# EAGLE design esp32_moisture (EAGLE 9.6.2)

## Sheet 1 of 2
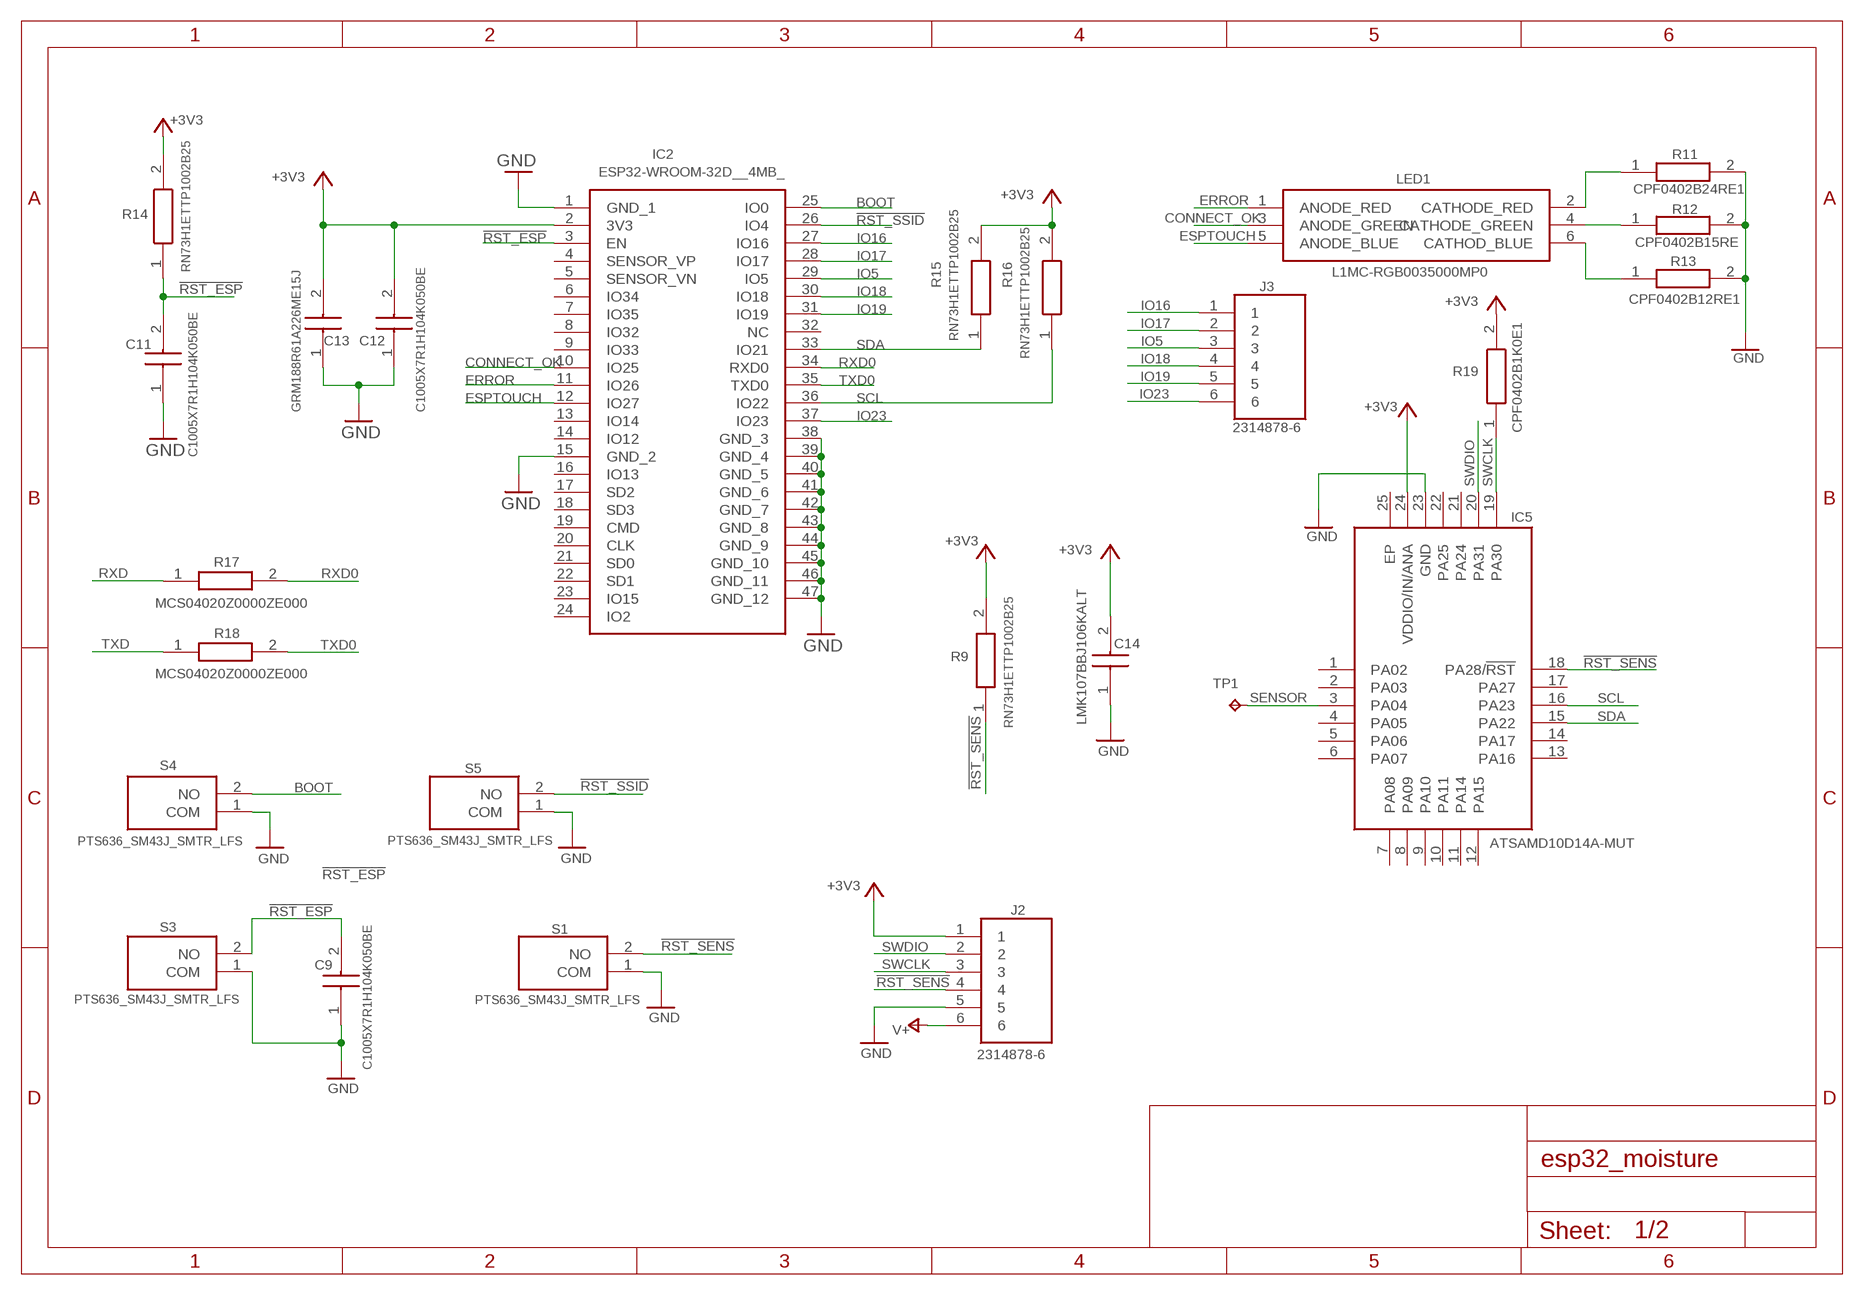
[diagram p0: schematic, sheet 1]

### Parts
C9  C1005X7R1H104K050BE  [CAPC1005X55N]
C11  C1005X7R1H104K050BE  [CAPC1005X55N]
C12  C1005X7R1H104K050BE  [CAPC1005X55N]
C13  GRM188R61A226ME15J  [CAPC1608X90N]
C14  LMK107BBJ106KALT  [CAPC1608X100N]
IC2  ESP32-WROOM-32D__4MB_  [ESP32WROOM32D4MB]
IC5  ATSAMD10D14A-MUT  [QFN50P400X400X90-25N]
J2  2314878-6  [RHDR6W40P0X200_1X6_1200X210X45]
J3  2314878-6  [RHDR6W40P0X200_1X6_1200X210X45]
LED1  L1MC-RGB0035000MP0  [L1MCRGB0035000MP0]
R9  RN73H1ETTP1002B25  [RESC1005X40N]
R11  CPF0402B24RE1  [RESC1005X35N]
R12  CPF0402B15RE  [RESC1005X35N]
R13  CPF0402B12RE1  [RESC1005X35N]
R14  RN73H1ETTP1002B25  [RESC1005X40N]
R15  RN73H1ETTP1002B25  [RESC1005X40N]
R16  RN73H1ETTP1002B25  [RESC1005X40N]
R17  MCS04020Z0000ZE000  [RESC1005X37N]
R18  MCS04020Z0000ZE000  [RESC1005X37N]
R19  CPF0402B1K0E1  [RESC1005X35N]
S1  PTS636_SM43J_SMTR_LFS  [PTS636SM43JSMTRLFS]
S3  PTS636_SM43J_SMTR_LFS  [PTS636SM43JSMTRLFS]
S4  PTS636_SM43J_SMTR_LFS  [PTS636SM43JSMTRLFS]
S5  PTS636_SM43J_SMTR_LFS  [PTS636SM43JSMTRLFS]
TP1  TPTP15R  [TP15R]

### Nets
!RST_ESP: C9.2 C11.2 IC2.3(EN) R14.1 S3.2(NO) ; also sheet 2
!RST_SENS: IC5.18(PA28/!RST) J2.4 R9.1 S1.2(NO)
!RST_SSID: IC2.26(IO4) S5.2(NO)
+3V3: C12.2 C13.2 C14.2 IC2.2(3V3) IC5.24(VDDIO/IN/ANA) J2.1 R9.2 R14.2 R15.2 R16.2 R19.2 ; also sheet 2
BOOT: IC2.25(IO0) S4.2(NO) ; also sheet 2
CONNECT_OK: IC2.10(IO25) LED1.3(ANODE_GREEN)
ERROR: IC2.11(IO26) LED1.1(ANODE_RED)
ESPTOUCH: IC2.12(IO27) LED1.5(ANODE_BLUE)
GND: C9.1 C11.1 C12.1 C13.1 C14.1 IC2.1(GND_1) IC2.15(GND_2) IC2.38(GND_3) IC2.39(GND_4) IC2.40(GND_5) IC2.41(GND_6) IC2.42(GND_7) IC2.43(GND_8) IC2.44(GND_9) IC2.45(GND_10) IC2.46(GND_11) IC2.47(GND_12) IC5.23(GND) J2.5 R11.2 R12.2 R13.2 S1.1(COM) S3.1(COM) S4.1(COM) S5.1(COM) ; also sheet 2
IO5: IC2.29(IO5) J3.3
IO16: IC2.27(IO16) J3.1
IO17: IC2.28(IO17) J3.2
IO18: IC2.30(IO18) J3.4
IO19: IC2.31(IO19) J3.5
IO23: IC2.37(IO23) J3.6
N$6: LED1.4(CATHODE_GREEN) R12.1
N$7: LED1.2(CATHODE_RED) R11.1
N$8: LED1.6(CATHOD_BLUE) R13.1
RXD: R17.1 ; also sheet 2
RXD0: IC2.34(RXD0) R17.2
SCL: IC2.36(IO22) IC5.16(PA23) R16.1
SDA: IC2.33(IO21) IC5.15(PA22) R15.1
SENSOR: IC5.3(PA04) TP1.TP
SWCLK: IC5.19(PA30) J2.3 R19.1
SWDIO: IC5.20(PA31) J2.2
TXD: R18.1 ; also sheet 2
TXD0: IC2.35(TXD0) R18.2
V+: J2.6 ; also sheet 2
Unconnected: IC2.4(SENSOR_VP) IC2.5(SENSOR_VN) IC2.6(IO34) IC2.7(IO35) IC2.8(IO32) IC2.9(IO33) IC2.13(IO14) IC2.14(IO12) IC2.16(IO13) IC2.17(SD2) IC2.18(SD3) IC2.19(CMD) IC2.20(CLK) IC2.21(SD0) IC2.22(SD1) IC2.23(IO15) IC2.24(IO2) IC2.32(NC) IC5.1(PA02) IC5.2(PA03) IC5.4(PA05) IC5.5(PA06) IC5.6(PA07) IC5.7(PA08) IC5.8(PA09) IC5.9(PA10) IC5.10(PA11) IC5.11(PA14) IC5.12(PA15) IC5.13(PA16) IC5.14(PA17) IC5.17(PA27) IC5.21(PA24) IC5.22(PA25) IC5.25(EP)

## Sheet 2 of 2
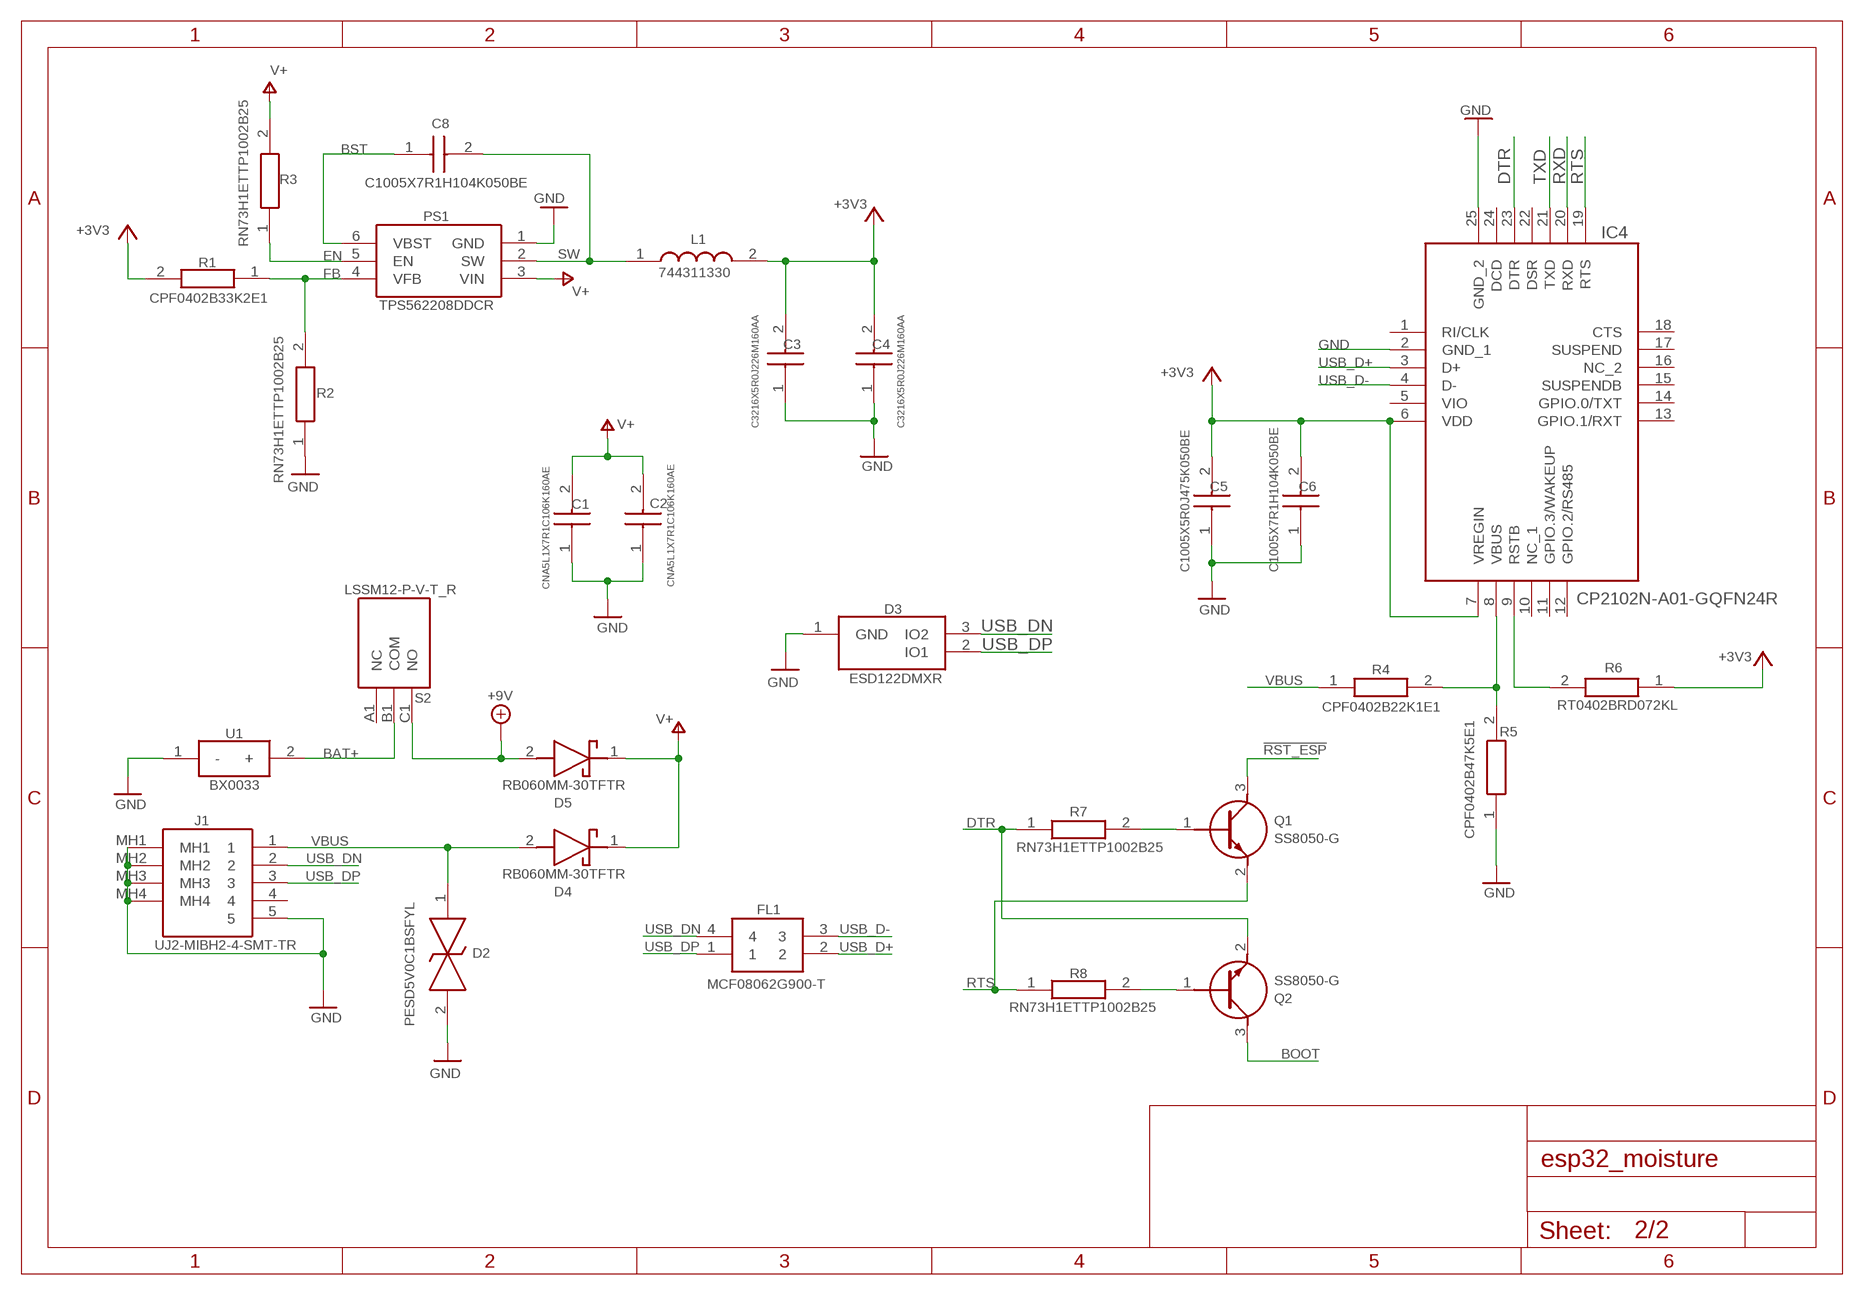
[diagram p1: schematic, sheet 2]
POWER (A4L-LOC): POWER: POWER

### Parts
C1  CNA5L1X7R1C106K160AE  [CAPC3216X180N]
C2  CNA5L1X7R1C106K160AE  [CAPC3216X180N]
C3  C3216X5R0J226M160AA  [CAPC3216X180N]
C4  C3216X5R0J226M160AA  [CAPC3216X180N]
C5  C1005X5R0J475K050BE  [CAPC1005X55N]
C6  C1005X7R1H104K050BE  [CAPC1005X55N]
C8  C1005X7R1H104K050BE  [CAPC1005X55N]
D2  PESD5V0C1BSFYL  [PESD5V0S1USF315]
D3  ESD122DMXR  [DMX0003A]
D4  RB060MM-30TFTR  [SODFL3516X90N]
D5  RB060MM-30TFTR  [SODFL3516X90N]
FL1  MCF08062G900-T  [MCF08062G900T]
IC4  CP2102N-A01-GQFN24R  [QFN50P400X400X80-25N]
J1  UJ2-MIBH2-4-SMT-TR  [UJ2MIBH24SMTTR]
L1  744311330  [WE-HCI_7030/7040/705023]
PS1  TPS562208DDCR  [SOT95P280X110-6N]
Q1  SS8050-G  [SOT95P240X115-3N]
Q2  SS8050-G  [SOT95P240X115-3N]
R1  CPF0402B33K2E1  [RESC1005X35N]
R2  RN73H1ETTP1002B25  [RESC1005X40N]
R3  RN73H1ETTP1002B25  [RESC1005X40N]
R4  CPF0402B22K1E1  [RESC1005X35N]
R5  CPF0402B47K5E1  [RESC1005X35N]
R6  RT0402BRD072KL  [RESC1005X35N]
R7  RN73H1ETTP1002B25  [RESC1005X40N]
R8  RN73H1ETTP1002B25  [RESC1005X40N]
S2  LSSM12-P-V-T_R  [LSSM12PVTR]
U1  BX0033  [BX0033]

### Nets
!RST_ESP: Q1.3(C) ; also sheet 1
+3V3: C3.2 C4.2 C5.2 C6.2 IC4.6(VDD) IC4.7(VREGIN) L1.2 R1.2 R6.1 ; also sheet 1
+9V: D5.2(A) S2.C1(NO)
BAT+: S2.B1(COM) U1.2(+)
BOOT: Q2.3(C) ; also sheet 1
BST: C8.1 PS1.6(VBST)
DTR: IC4.23(DTR) Q2.2(E) R7.1
EN: PS1.5(EN) R3.1
FB: PS1.4(VFB) R1.1 R2.2
GND: C1.1 C2.1 C3.1 C4.1 C5.1 C6.1 D2.2 D3.1(GND) IC4.2(GND_1) IC4.25(GND_2) J1.5 J1.MH1 J1.MH2 J1.MH3 J1.MH4 PS1.1(GND) R2.1 R5.1 U1.1(-) ; also sheet 1
N$1: IC4.9(RSTB) R6.2
N$2: Q1.1(B) R7.2
N$3: Q2.1(B) R8.2
N$4: IC4.8(VBUS) R4.2 R5.2
RTS: IC4.19(RTS) Q1.2(E) R8.1
RXD: IC4.20(RXD) ; also sheet 1
SW: C8.2 L1.1 PS1.2(SW)
TXD: IC4.21(TXD) ; also sheet 1
USB_D+: FL1.2 IC4.3(D+)
USB_D-: FL1.3 IC4.4(D-)
USB_DN: D3.3(IO2) FL1.4 J1.2
USB_DP: D3.2(IO1) FL1.1 J1.3
V+: C1.2 C2.2 D4.1(K) D5.1(K) PS1.3(VIN) R3.2 ; also sheet 1
VBUS: D2.1 D4.2(A) J1.1 R4.1
Unconnected: IC4.1(RI/CLK) IC4.5(VIO) IC4.10(NC_1) IC4.11(GPIO.3/WAKEUP) IC4.12(GPIO.2/RS485) IC4.13(GPIO.1/RXT) IC4.14(GPIO.0/TXT) IC4.15(SUSPENDB) IC4.16(NC_2) IC4.17(SUSPEND) IC4.18(CTS) IC4.22(DSR) IC4.24(DCD) J1.4 S2.A1(NC)

## Library data of the parts
C1 C2 = CNA5L1X7R1C106K160AE:CNA5L1X7R1C106K160AE: Multilayer Ceramic Capacitors MLCC - SMD/SMT 1206 16V 10uF 10% Soft Term AEC-Q200 Source: Datasheet <https://componentsearchengine.com//CNA5L1X7R1C106K160AE.pdf>; DESCRIPTION: Multilayer Ceramic Capacitors MLCC - SMD/SMT 1206 16V 10uF 10% Soft Term AEC-Q200; HEIGHT: 1.8mm; MANUFACTURER_NAME: TDK; MANUFACTURER_PART_NUMBER: CNA5L1X7R1C106K160AE; MOUSER2_PART_NUMBER: 810-CNA5L1X7R1C106K1; MOUSER2_PRICE-STOCK: https://www.mouser.com/Search/Refine.aspx?Keyword=810-CNA5L1X7R1C106K1
C3 C4 = C3216X5R0J226M160AA:C3216X5R0J226M160AA: TDK - C3216X5R0J226M160AA - CERAMIC CAPACITOR, 22UF, 6.3V, X5R, 20%, Source: Datasheet <https://product.tdk.com/info/en/catalog/datasheets/mlcc_commercial_midvoltage_en.pdf>; DESCRIPTION: TDK - C3216X5R0J226M160AA - CERAMIC CAPACITOR, 22UF, 6.3V, X5R, 20%,; HEIGHT: 1.8mm; MANUFACTURER_NAME: TDK; MANUFACTURER_PART_NUMBER: C3216X5R0J226M160AA
C5 = C1005X5R0J475K050BE:C1005X5R0J475K050BE: Multilayer Ceramic Capacitors MLCC - SMD/SMT 0402 6.3V 4.70uF X5R 10% Soft Term Source: Datasheet <https://product.tdk.com/info/en/catalog/datasheets/mlcc_commercial_midvoltage_en.pdf>; DESCRIPTION: Multilayer Ceramic Capacitors MLCC - SMD/SMT 0402 6.3V 4.70uF X5R 10% Soft Term; HEIGHT: 0.55mm; MANUFACTURER_NAME: TDK; MANUFACTURER_PART_NUMBER: C1005X5R0J475K050BE
C6 C8 C9 C11 C12 = C1005X7R1H104K050BE:C1005X7R1H104K050BE: Multilayer Ceramic Capacitors MLCC - SMD/SMT 0402 0.1uF 50volts X7R 10% Soft Term Source: Datasheet <https://componentsearchengine.com//C1005X7R1H104K050BE.pdf>; DESCRIPTION: Multilayer Ceramic Capacitors MLCC - SMD/SMT 0402 0.1uF 50volts X7R 10% Soft Term; HEIGHT: 0.55mm; MANUFACTURER_NAME: TDK; MANUFACTURER_PART_NUMBER: C1005X7R1H104K050BE; MOUSER2_PART_NUMBER: 810-C1005X7R1H104KBE; MOUSER2_PRICE-STOCK: https://www.mouser.com/Search/Refine.aspx?Keyword=810-C1005X7R1H104KBE
C13 = GRM188R61A226ME15J:GRM188R61A226ME15J: Multilayer Ceramic Capacitors MLCC - SMD/SMT 0603 22uF 10volts *Derate Voltage/Temp Source: Datasheet <https://componentsearchengine.com//GRM188R61A226ME15J.pdf>; DESCRIPTION: Multilayer Ceramic Capacitors MLCC - SMD/SMT 0603 22uF 10volts *Derate Voltage/Temp; HEIGHT: 0.9mm; MANUFACTURER_NAME: Murata Electronics; MANUFACTURER_PART_NUMBER: GRM188R61A226ME15J; MOUSER2_PART_NUMBER: 81-GRM188R61A226ME5J; MOUSER2_PRICE-STOCK: https://www.mouser.com/Search/Refine.aspx?Keyword=81-GRM188R61A226ME5J
C14 = LMK107BBJ106KALT:LMK107BBJ106KALT: Multilayer Ceramic Capacitors MLCC - SMD/SMT 10uF 10V X5R 10% 0603 Source: Datasheet <https://componentsearchengine.com//LMK107BBJ106KALT.pdf>; DESCRIPTION: Multilayer Ceramic Capacitors MLCC - SMD/SMT 10uF 10V X5R 10% 0603; HEIGHT: 1mm; MANUFACTURER_NAME: TAIYO YUDEN; MANUFACTURER_PART_NUMBER: LMK107BBJ106KALT; MOUSER2_PART_NUMBER: 963-LMK107BBJ106KALT; MOUSER2_PRICE-STOCK: https://www.mouser.com/Search/Refine.aspx?Keyword=963-LMK107BBJ106KALT
D2 = PESD5V0C1BSFYL:PESD5V0C1BSFYL: ESD Diode 5V Bidir Low Cap Auto DSN0603 Source: Datasheet <https://componentsearchengine.com//PESD5V0C1BSFYL.pdf>; DESCRIPTION: ESD Diode 5V Bidir Low Cap Auto DSN0603; HEIGHT: 0mm; MANUFACTURER_NAME: Nexperia; MANUFACTURER_PART_NUMBER: PESD5V0C1BSFYL; MOUSER2_PART_NUMBER: 771-PESD5V0C1BSFYL; MOUSER2_PRICE-STOCK: https://www.mouser.com/Search/Refine.aspx?Keyword=771-PESD5V0C1BSFYL
D3 = ESD122DMXR:ESD122DMXR: 2-Channel ESD Protection Diode for USB Type-C and HDMI 2.0 Source: Datasheet <http://www.ti.com/lit/gpn/esd122>; DESCRIPTION: 2-Channel ESD Protection Diode for USB Type-C and HDMI 2.0; HEIGHT: mm; MANUFACTURER_NAME: Texas Instruments; MANUFACTURER_PART_NUMBER: ESD122DMXR
D4 D5 = RB060MM-30TFTR:RB060MM-30TFTR: ROHM - RB060MM-30TFTR - SCHOTTKY RECT, AEC-Q101, 30V, SOD-123FL Source: Datasheet <https://componentsearchengine.com//RB060MM-30TFTR.pdf>; DESCRIPTION: ROHM - RB060MM-30TFTR - SCHOTTKY RECT, AEC-Q101, 30V, SOD-123FL; HEIGHT: 0.9mm; MANUFACTURER_NAME: ROHM Semiconductor; MANUFACTURER_PART_NUMBER: RB060MM-30TFTR; MOUSER2_PART_NUMBER: 755-RB060MM-30TFTR; MOUSER2_PRICE-STOCK: https://www.mouser.com/Search/Refine.aspx?Keyword=755-RB060MM-30TFTR
FL1 = MCF08062G900-T:MCF08062G900-T: 2 Line Common Mode Choke Surface Mount 90 Ohms @ 100MHz 100mA DCR 5Ohm Source: Datasheet <https://ds.yuden.co.jp/TYCOMPAS/ut/detail?pn=MCF08062G900-T&u=M>; ARROW_PART_NUMBER: MCF08062G900-T; ARROW_PRICE-STOCK: https://www.arrow.com/en/products/mcf08062g900-t/taiyo-yuden; DESCRIPTION: 2 Line Common Mode Choke Surface Mount 90 Ohms @ 100MHz 100mA DCR 5Ohm; HEIGHT: 0.45mm; MANUFACTURER_NAME: TAIYO YUDEN; MANUFACTURER_PART_NUMBER: MCF08062G900-T; MOUSER_PART_NUMBER: 963-MCF08062G900-T; MOUSER_PRICE-STOCK: https://www.mouser.co.uk/ProductDetail/Taiyo-Yuden/MCF08062G900-T?qs=CNQs48zzdnrUejndyaTfyQ%3D%3D
IC2 = ESP32-WROOM-32D__4MB_:ESP32-WROOM-32D__4MB_: WiFi Modules (802.11) SMD Module, ESP32-D0WD, 32Mbits SPI flash, UART mode, PCB antenna Source: Datasheet <https://componentsearchengine.com/Datasheets/1/ESP32-WROOM-32D (4MB).pdf>; DESCRIPTION: WiFi Modules (802.11) SMD Module, ESP32-D0WD, 32Mbits SPI flash, UART mode, PCB antenna; HEIGHT: 3.2mm; MANUFACTURER_NAME: Espressif Systems; MANUFACTURER_PART_NUMBER: ESP32-WROOM-32D (4MB); MOUSER_PART_NUMBER: 356-ESP32WROOM-32D; MOUSER_PRICE-STOCK: https://www.mouser.co.uk/ProductDetail/Espressif-Systems/ESP32-WROOM-32D-4MB?qs=GBLSl2AkirvkALo4fyKM5Q%3D%3D
IC4 = CP2102N-A01-GQFN24R:CP2102N-A01-GQFN24R: USB Interface IC USB - UART serial bridge - QFN24 Source: Datasheet <https://componentsearchengine.com//CP2102N-A01-GQFN24R.pdf>; DESCRIPTION: USB Interface IC USB - UART serial bridge - QFN24; HEIGHT: 0.8mm; MANUFACTURER_NAME: Silicon Labs; MANUFACTURER_PART_NUMBER: CP2102N-A01-GQFN24R; MOUSER2_PART_NUMBER: 634-CP02NA01GQFN24R; MOUSER2_PRICE-STOCK: https://www.mouser.com/Search/Refine.aspx?Keyword=634-CP02NA01GQFN24R
IC5 = ATSAMD10D14A-MUT:ATSAMD10D14A-MUT: ARM Microcontrollers - MCU Source: Datasheet <https://www.mouser.com/datasheet/2/268/Atmel-42242-SAM-D10_Datasheet-1368658.pdf>; ARROW_PART_NUMBER: ATSAMD10D14A-MUT; ARROW_PRICE-STOCK: https://www.arrow.com/en/products/atsamd10d14a-mut/microchip-technology; DESCRIPTION: ARM Microcontrollers - MCU; HEIGHT: 0.9mm; MANUFACTURER_NAME: Microchip; MANUFACTURER_PART_NUMBER: ATSAMD10D14A-MUT; MOUSER_PART_NUMBER: 556-ATSAMD10D14A-MUT; MOUSER_PRICE-STOCK: https://www.mouser.co.uk/ProductDetail/Microchip-Technology-Atmel/ATSAMD10D14A-MUT?qs=lrqjml%252Bjt8dee5nXQqeVoQ%3D%3D
J1 = UJ2-MIBH2-4-SMT-TR:UJ2-MIBH2-4-SMT-TR: CONN RCPT USB2.0 MICRO B SMD R/A Source: Datasheet <https://componentsearchengine.com//UJ2-MIBH2-4-SMT-TR.pdf>; DESCRIPTION: CONN RCPT USB2.0 MICRO B SMD R/A; HEIGHT: 2.5mm; MANUFACTURER_NAME: CUI Devices; MANUFACTURER_PART_NUMBER: UJ2-MIBH2-4-SMT-TR; MOUSER2_PART_NUMBER: 490-UJ2-MIBH2-4-SMT; MOUSER2_PRICE-STOCK: https://www.mouser.com/Search/Refine.aspx?Keyword=490-UJ2-MIBH2-4-SMT
J2 J3 = 2314878-6:2314878-6: Board to Board & Mezzanine Connectors 6P,2MM,B-B,REC,SRVT, 2.7,0.76AU,TB Source: Datasheet <https://www.mouser.de/ProductDetail/TE-Connectivity/2314878-6?qs=P1JMDcb91o5swMgljHKMGQ==>; DESCRIPTION: Board to Board & Mezzanine Connectors 6P,2MM,B-B,REC,SRVT, 2.7,0.76AU,TB; HEIGHT: 4.5mm; MANUFACTURER_NAME: TE Connectivity; MANUFACTURER_PART_NUMBER: 2314878-6
L1 = 744311330:744311330: SMD-Flat Wire High Current Inductor WE-HCI Source: Datasheet <http://componentsearchengine.com/Datasheets/1/744311330.pdf>; DESCRIPTION: SMD-Flat Wire High Current Inductor WE-HCI; HEIGHT: mm; MANUFACTURER_NAME: Wurth Elektronik; MANUFACTURER_PART_NUMBER: 744311330
LED1 = L1MC-RGB0035000MP0:L1MC-RGB0035000MP0: 2.5 V, 3.4 V RGB LED 3535 SMD, Lumileds LUXEON 3535L L1MC-RGB0035000MP0 Source: Datasheet <https://www.lumileds.com/uploads/803/DS242-luxeon-multicolor-module-0-5w-datasheet-pdf>; DESCRIPTION: 2.5 V, 3.4 V RGB LED 3535 SMD, Lumileds LUXEON 3535L L1MC-RGB0035000MP0; HEIGHT: 2.8mm; MANUFACTURER_NAME: Lumileds; MANUFACTURER_PART_NUMBER: L1MC-RGB0035000MP0
PS1 = TPS562208DDCR:TPS562208DDCR: 4.5V to 17V Input, 2A Output, Synchronous SWIFT Step-Down Converter Source: Datasheet <http://www.ti.com/lit/gpn/tps562208>; DESCRIPTION: 4.5V to 17V Input, 2A Output, Synchronous SWIFT Step-Down Converter; HEIGHT: 1.1mm; MANUFACTURER_NAME: Texas Instruments; MANUFACTURER_PART_NUMBER: TPS562208DDCR; MOUSER_PART_NUMBER: 595-TPS562208DDCR; MOUSER_PRICE-STOCK: https://www.mouser.co.uk/ProductDetail/Texas-Instruments/TPS562208DDCR?qs=G55MHhPmvtKViOS%252B3JHn2g%3D%3D
Q1 Q2 = SS8050-G:SS8050-G: Bipolar Transistors - BJT NPN TRANSISTOR 1.5A 40V Source: Datasheet <https://componentsearchengine.com//SS8050-G.pdf>; DESCRIPTION: Bipolar Transistors - BJT NPN TRANSISTOR 1.5A 40V; HEIGHT: 1.15mm; MANUFACTURER_NAME: Comchip Technology; MANUFACTURER_PART_NUMBER: SS8050-G; MOUSER2_PART_NUMBER: 750-SS8050-G; MOUSER2_PRICE-STOCK: https://www.mouser.com/Search/Refine.aspx?Keyword=750-SS8050-G
R1 = CPF0402B33K2E1:CPF0402B33K2E1: TE Connectivity CPF Series Precision Thin Film Surface Mount Resistor 0402 Case 33.2k +/-0.1% 0.063W +/-25ppm/C Source: Datasheet; DESCRIPTION: TE Connectivity CPF Series Precision Thin Film Surface Mount Resistor 0402 Case 33.2k +/-0.1% 0.063W +/-25ppm/C; HEIGHT: 0.35mm; MANUFACTURER_NAME: TE Connectivity; MANUFACTURER_PART_NUMBER: CPF0402B33K2E1
R2 R3 R7-R9 R14-R16 = RN73H1ETTP1002B25:RN73H1ETTP1002B25: Res Thin Film 0402 10K Ohm 0.1% 0.063W(1/16W) +/-25ppm/C Pad SMD Automotive T/R Source: Datasheet <https://componentsearchengine.com//RN73H1ETTP1002B25.pdf>; DESCRIPTION: Res Thin Film 0402 10K Ohm 0.1% 0.063W(1/16W) +/-25ppm/C Pad SMD Automotive T/R; HEIGHT: 0.4mm; MANUFACTURER_NAME: KOA Speer; MANUFACTURER_PART_NUMBER: RN73H1ETTP1002B25; MOUSER2_PART_NUMBER: 660-RN73H1ETP1002B25; MOUSER2_PRICE-STOCK: https://www.mouser.com/Search/Refine.aspx?Keyword=660-RN73H1ETP1002B25
R4 = CPF0402B22K1E1:CPF0402B22K1E1: TE Connectivity CPF Series Precision Thin Film Surface Mount Resistor 0402 Case 22.1k +/-0.1% 0.063W +/-25ppm/C Source: Datasheet; DESCRIPTION: TE Connectivity CPF Series Precision Thin Film Surface Mount Resistor 0402 Case 22.1k +/-0.1% 0.063W +/-25ppm/C; HEIGHT: 0.35mm; MANUFACTURER_NAME: TE Connectivity; MANUFACTURER_PART_NUMBER: CPF0402B22K1E1
R5 = CPF0402B47K5E1:CPF0402B47K5E1: TE Connectivity CPF Series Precision Thin Film Surface Mount Resistor 0402 Case 47.5k +/-0.1% 0.063W +/-25ppm/C Source: Datasheet; DESCRIPTION: TE Connectivity CPF Series Precision Thin Film Surface Mount Resistor 0402 Case 47.5k +/-0.1% 0.063W +/-25ppm/C; HEIGHT: 0.35mm; MANUFACTURER_NAME: TE Connectivity; MANUFACTURER_PART_NUMBER: CPF0402B47K5E1
R6 = RT0402BRD072KL:RT0402BRD072KL: Thin Film Resistors - SMD 1/16W 2K ohm .1% 25ppm Source: Datasheet; DESCRIPTION: Thin Film Resistors - SMD 1/16W 2K ohm .1% 25ppm; HEIGHT: 0.35mm; MANUFACTURER_NAME: YAGEO (PHYCOMP); MANUFACTURER_PART_NUMBER: RT0402BRD072KL
R11 = CPF0402B24RE1:CPF0402B24RE1: 24 0402 Thin Film Precision Thin Film Surface Mount Resistor +/-0.1% 0.063W CPF0402B24RE1 Source: Datasheet; DESCRIPTION: 24 0402 Thin Film Precision Thin Film Surface Mount Resistor +/-0.1% 0.063W CPF0402B24RE1; HEIGHT: 0.35mm; MANUFACTURER_NAME: TE Connectivity; MANUFACTURER_PART_NUMBER: CPF0402B24RE1
R12 = CPF0402B15RE:CPF0402B15RE: 15 0402 Thin Film Precision Thin Film Surface Mount Resistor +/-0.1% 0.063W CPF0402B15RE Source: Datasheet; DESCRIPTION: 15 0402 Thin Film Precision Thin Film Surface Mount Resistor +/-0.1% 0.063W CPF0402B15RE; HEIGHT: 0.35mm; MANUFACTURER_NAME: TE Connectivity; MANUFACTURER_PART_NUMBER: CPF0402B15RE
R13 = CPF0402B12RE1:CPF0402B12RE1: TE Connectivity CPF Series Precision Thin Film Surface Mount Resistor 402 Case 12 +/-0.1% 0.063W +/-25ppm/C Source: Datasheet; DESCRIPTION: TE Connectivity CPF Series Precision Thin Film Surface Mount Resistor 402 Case 12 +/-0.1% 0.063W +/-25ppm/C; HEIGHT: 0.35mm; MANUFACTURER_NAME: TE Connectivity; MANUFACTURER_PART_NUMBER: CPF0402B12RE1
R17 R18 = MCS04020Z0000ZE000:MCS04020Z0000ZE000: Thin Film Resistors - SMD .063w ZEROohm Jumper Source: Datasheet <http://www.vishay.com/docs/28705/mcx0x0xpro.pdf>; DESCRIPTION: Thin Film Resistors - SMD .063w ZEROohm Jumper; HEIGHT: 0.37mm; MANUFACTURER_NAME: Vishay; MANUFACTURER_PART_NUMBER: MCS04020Z0000ZE000
R19 = CPF0402B1K0E1:CPF0402B1K0E1: CPF0402 Chip Resistor 1K0 25PPM TE Connectivity CPF Series Precision Thin Film Surface Mount Resistor 0402 Case 1k +/-0.1% 0.063W +/-25ppm/C Source: Datasheet; DESCRIPTION: CPF0402 Chip Resistor 1K0 25PPM TE Connectivity CPF Series Precision Thin Film Surface Mount Resistor 0402 Case 1k +/-0.1% 0.063W +/-25ppm/C; HEIGHT: 0.35mm; MANUFACTURER_NAME: TE Connectivity; MANUFACTURER_PART_NUMBER: CPF0402B1K0E1; MOUSER2_PART_NUMBER: 279-CPF0402B1K0E1; MOUSER2_PRICE-STOCK: https://www.mouser.com/Search/Refine.aspx?Keyword=279-CPF0402B1K0E1
S1 S3-S5 = PTS636_SM43J_SMTR_LFS:PTS636_SM43J_SMTR_LFS: Tactile Switches Tact 50mA 12VDC, 6.0x3.5, 4.3mm H, 180gf, J leads, No ground pin, Black Actuator Source: Datasheet <https://componentsearchengine.com/Datasheets/1/PTS636 SM43J SMTR LFS.pdf>; DESCRIPTION: Tactile Switches Tact 50mA 12VDC, 6.0x3.5, 4.3mm H, 180gf, J leads, No ground pin, Black Actuator; HEIGHT: 4.3mm; MANUFACTURER_NAME: C & K COMPONENTS; MANUFACTURER_PART_NUMBER: PTS636 SM43J SMTR LFS
S2 = LSSM12-P-V-T_R:LSSM12-P-V-T_R: Slide Switches SLIDE SWITCH 1P2T WITH POST Source: Datasheet <https://www.mouser.in/ProductDetail/Diptronics/LSSM12-P-V-T-R?qs=wnTfsH77Xs4YChp1btkL4g==>; DESCRIPTION: Slide Switches SLIDE SWITCH 1P2T WITH POST; HEIGHT: 3.5mm; MANUFACTURER_NAME: Diptronics; MANUFACTURER_PART_NUMBER: LSSM12-P-V-T/R; MOUSER_PART_NUMBER: 113-LSSM12PVT/R; MOUSER_PRICE-STOCK: https://www.mouser.co.uk/ProductDetail/Diptronics/LSSM12-P-V-T-R?qs=wnTfsH77Xs4YChp1btkL4g%3D%3D
TP1 = testpad:TP: Test pad
U1 = BX0033:BX0033: Bulgin 9V PP3 PCB Battery Holder, Leaf Spring Contact Source: Datasheet <http://www.bulgin.com/media/bulgin/data/Battery_holders.pdf>; ARROW_PART_NUMBER: BX0033; ARROW_PRICE-STOCK: https://www.arrow.com/en/products/bx0033/bulgin-components-plc; DESCRIPTION: Bulgin 9V PP3 PCB Battery Holder, Leaf Spring Contact; HEIGHT: mm; MANUFACTURER_NAME: Bulgin; MANUFACTURER_PART_NUMBER: BX0033; MOUSER_PART_NUMBER: 122-BX0033; MOUSER_PRICE-STOCK: https://www.mouser.co.uk/ProductDetail/Bulgin/BX0033?qs=mZhjc5a7U8zJAJTATpoz8g%3D%3D

## Net classes
0 default: clearance 0.205 mm

## Board
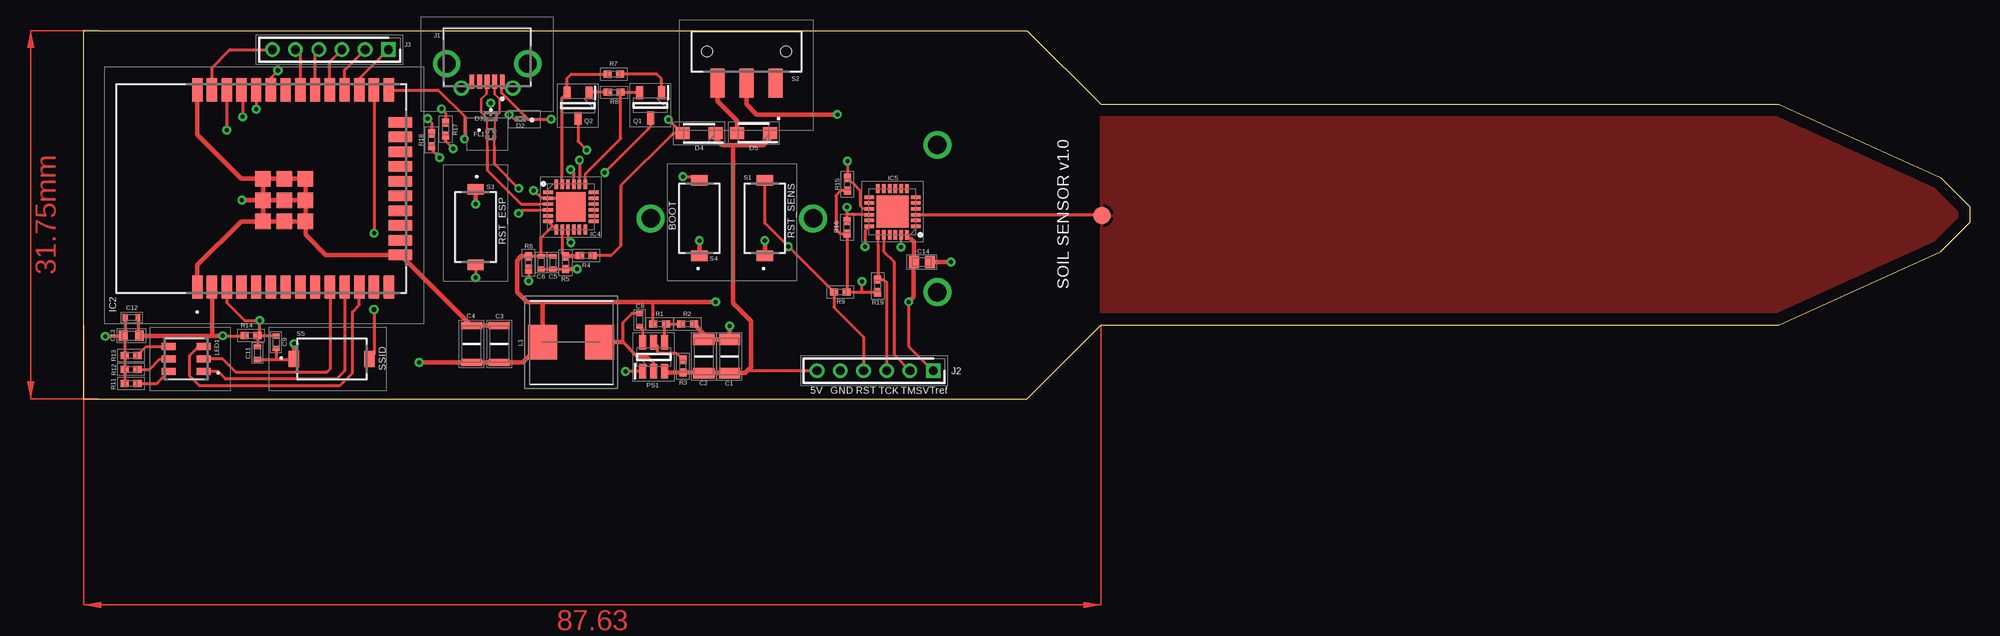
[diagram p2: board, top side]
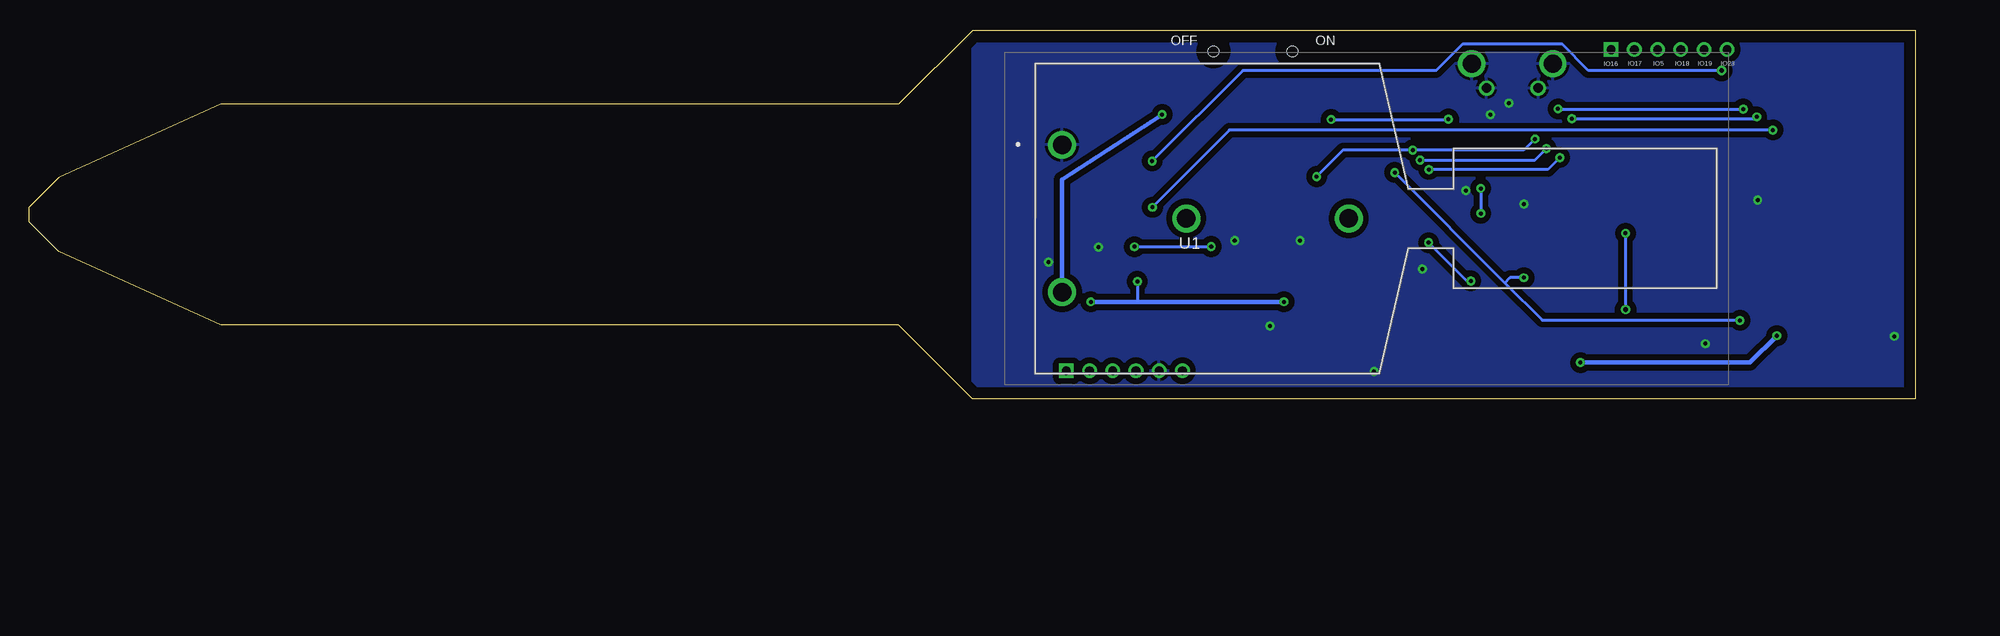
[diagram p3: board, bottom side, seen from below]

Size 162.56 x 31.75 mm. Coordinates in mm from the lower left corner, seen from the top.
Outline: 0,0 81.28,0 87.63,6.35 146.05,6.35 160.02,12.7 162.56,15.24 162.56,16.51 160.02,19.05 146.05,25.4 87.63,25.4 81.28,31.75 0,31.75 0,0
Copper layers (1*16): Top 0.035mm / dielectric 1.5mm / Bottom 0.035mm
Design rules "default *": minimum track width 6mil, minimum drill 0.35mm, track to track 8mil, track to pad 8mil, pad to pad 10mil, via to via 10mil, smd to smd 6mil, copper to edge 40mil, drill to drill 12mil, minimum pad ring 10mil, minimum via ring 8mil, stop-mask expansion 4mil, vias tented up to drill 0mil, thermal gap 10mil

### Footprints (pad centres in the part's own frame; a part is rotated, then mirrored left to right if it is on the bottom)
CAPC3216X180N = smd 0.92 x 1.82: 1 -1.45,0; 2 1.45,0
CAPC3216X180N' = smd 0.62 x 1.82: 1 -1.6,0; 2 1.6,0
CAPC1005X55N = smd 0.42 x 0.62: 1 -0.55,0; 2 0.55,0
CAPC1608X90N = smd 0.75 x 0.94: 1 -0.7,0; 2 0.7,0
CAPC1608X100N = smd 0.87 x 1.02: 1 -0.68,0; 2 0.68,0
PESD5V0S1USF315 = smd 0.12 x 0.22: 1 0.137,-0.025; 2 0.537,-0.025
DMX0003A = smd 0.2 x 0.2: 1 -0.15,0; 2 0.15,-0.34; 3 0.15,0.34
SODFL3516X90N = smd 1.21 x 1.04: 1 -1.425,0; 2 1.425,0
MCF08062G900T = smd 0.3 x 0.3: 1 -0.25,-0.3; 2 0.25,-0.3; 3 0.25,0.3; 4 -0.25,0.3
ESP32WROOM32D4MB = smd 2 x 0.9: 1 0,0.01; 2 0,-1.26; 3 0,-2.53; 4 0,-3.8; 5 0,-5.07; 6 0,-6.34; 7 0,-7.61; 8 0,-8.88; 9 0,-10.15; 10 0,-11.42; 11 0,-12.69; 12 0,-13.96; 13 0,-15.23; 14 0,-16.5; 25 17,-16.5; 26 17,-15.23; 27 17,-13.96; 28 17,-12.69; 29 17,-11.42; 30 17,-10.15; 31 17,-8.88; 32 17,-7.61; 33 17,-6.34; 34 17,-5.07; 35 17,-3.8; 36 17,-2.53; 37 17,-1.26; 38 17,0.01 | smd 0.9 x 2: 15 2.785,-17.5; 16 4.055,-17.5; 17 5.325,-17.5; 18 6.595,-17.5; 19 7.865,-17.5; 20 9.135,-17.5; 21 10.405,-17.5; 22 11.675,-17.5; 23 12.945,-17.5; 24 14.215,-17.5 | smd 1.33 x 1.33: 39 5.665,-5.655; 40 5.665,-7.49; 41 5.665,-9.325; 42 7.5,-9.325; 43 9.335,-9.325; 44 9.335,-7.49; 45 9.335,-5.655; 46 7.5,-5.655; 47 7.5,-7.49
QFN50P400X400X80-25N = smd 0.85 x 0.3: 1 -1.95,1.25; 2 -1.95,0.75; 3 -1.95,0.25; 4 -1.95,-0.25; 5 -1.95,-0.75; 6 -1.95,-1.25; 13 1.95,-1.25; 14 1.95,-0.75; 15 1.95,-0.25; 16 1.95,0.25; 17 1.95,0.75; 18 1.95,1.25 | smd 0.3 x 0.85: 7 -1.25,-1.95; 8 -0.75,-1.95; 9 -0.25,-1.95; 10 0.25,-1.95; 11 0.75,-1.95; 12 1.25,-1.95; 19 1.25,1.95; 20 0.75,1.95; 21 0.25,1.95; 22 -0.25,1.95; 23 -0.75,1.95; 24 -1.25,1.95 | smd 2.55 x 2.55: 25 0,0
QFN50P400X400X90-25N = smd 0.8 x 0.3: 1 -2,1.25; 2 -2,0.75; 3 -2,0.25; 4 -2,-0.25; 5 -2,-0.75; 6 -2,-1.25; 13 2,-1.25; 14 2,-0.75; 15 2,-0.25; 16 2,0.25; 17 2,0.75; 18 2,1.25 | smd 0.3 x 0.8: 7 -1.25,-2; 8 -0.75,-2; 9 -0.25,-2; 10 0.25,-2; 11 0.75,-2; 12 1.25,-2; 19 1.25,2; 20 0.75,2; 21 0.25,2; 22 -0.25,2; 23 -0.75,2; 24 -1.25,2 | smd 2.75 x 2.75: 25 0,0
UJ2MIBH24SMTTR = smd 1.2 x 0.4: 1 2.025,1.3; 2 2.025,0.65; 3 2.025,0; 4 2.025,-0.65; 5 2.025,-1.3 | drill 0.8 pad 1.2: MH1 2.575,2.225; MH2 2.575,-2.225 | drill 1.565 pad 2.348: MH3 0.475,-3.5; MH4 0.475,3.5
RHDR6W40P0X200_1X6_1200X210X45 = drill 0.75 pad 1.15 square: 1 0,0 | drill 0.75 pad 1.15: 2 2,0; 3 4,0; 4 6,0; 5 8,0; 6 10,0
WE-HCI_7030/7040/705023 = smd 2.5 x 3: 1 -2.45,0; 2 2.45,0
L1MCRGB0035000MP0 = smd 1.2 x 0.6: 1 -1.5,1.08; 2 1.5,1.08; 3 -1.5,0; 4 1.5,0; 5 -1.5,-1.08; 6 1.5,-1.08
SOT95P280X110-6N = smd 1.25 x 0.6: 1 -1.25,0.95; 2 -1.25,0; 3 -1.25,-0.95; 4 1.25,-0.95; 5 1.25,0; 6 1.25,0.95
SOT95P240X115-3N = smd 1.1 x 0.6: 1 -1.1,0.95; 2 -1.1,-0.95; 3 1.1,0
RESC1005X35N = smd 0.7 x 0.6: 1 -0.55,0; 2 0.55,0
RESC1005X40N = smd 0.7 x 0.6: 1 -0.55,0; 2 0.55,0
RESC1005X35N' = smd 0.75 x 0.6: 1 -0.55,0; 2 0.55,0
RESC1005X37N = smd 0.7 x 0.6: 1 -0.55,0; 2 0.55,0
PTS636SM43JSMTRLFS = smd 0.9 x 1.4: 1 -3.25,0; 2 3.25,0
LSSM12PVTR = smd 1.2 x 2.5: A1 -2.5,2.75; B1 0,2.75; C1 2.5,2.75 | hole 0.9: -3.4,0; 3.4,0
TP15R = smd 1.5 x 1.5: TP 0,0
BX0033 = drill 1.6 pad 2.4: 1 2.3,6.35; 2 2.3,-6.35; 3 13,0; 4 27,0

### Placement (x,y rotation side)
C1  55.63,3.66 270 top
C2  53.42,3.66 270 top
C3  C3216X5R0J226M160AA  [CAPC3216X180N']  35.79,4.72 270 top
C4  C3216X5R0J226M160AA  [CAPC3216X180N']  33.4,4.72 270 top
C5  40.41,11.73 90 top
C6  39.4,11.73 90 top
C8  47.88,6.81 90 top
C9  16.56,4.88 90 top
C11  14.96,3.94 90 top
C12  4.11,7.01 0 top
C13  4.09,5.44 0 top
C14  72.21,11.79 180 top
D2  37.95,24.1 180 top
D3  35.05,24.33 270 top
D4  53.01,22.89 180 top
D5  57.71,22.91 180 top
FL1  35.05,22.81 270 top
IC2  9.78,9.63 90 top
IC4  41.96,16.54 0 top
IC5  69.67,16.13 180 top
J1  34.75,29.36 270 top
J2  73.18,2.41 180 top
J3  26.24,30.1 180 top
L1  41.99,4.88 180 top
LED1  8.81,3.43 180 top
PS1  49.1,3.61 90 top
Q1  48.82,25.3 270 top
Q2  42.57,25.27 270 top
R1  49.61,6.45 180 top
R2  52.02,6.45 180 top
R3  51.61,2.82 270 top
R4  43.28,12.34 180 top
R5  41.5,11.73 90 top
R6  RT0402BRD072KL  [RESC1005X35N']  38.3,11.73 270 top
R7  45.67,27.99 0 top
R8  45.69,26.42 180 top
R9  65.18,9.19 0 top
R11  4.06,1.32 180 top
R12  4.06,2.54 180 top
R13  4.06,3.73 180 top
R14  14.4,5.46 180 top
R15  65.79,18.49 270 top
R16  65.76,14.78 270 top
R17  31.17,23.24 90 top
R18  29.97,22.33 90 top
R19  68.4,9.73 270 top
S1  58.67,15.57 90 top
S2  57.1,29.95 180 top
S3  33.76,14.81 270 top
S4  53.04,15.57 90 top
S5  21.36,3.43 0 top
TP1  87.73,15.8 0 top
U1  75.84,15.54 0 bottom

### Tracks (layer width: path | path; a pad name or v marks a point on that pad's centre or on a via)
!RST_ESP  (via drill 0.35)
  Top 0.254: Q1.3 48.82,23.44 v44.88,19.51 | S3.2 v33.76,10.44 | IC2.3 12.31,8.29 13.84,6.76 v15.14,6.76 15.14,5.65 R14.1 | R14.1 14.96,5.45 C11.2 | R14.1 16.53,5.46 C9.2
  Bottom 0.254: v15.14,6.76 15.16,6.78 32.18,6.78 35.4,9.99 | v44.88,19.51 44.88,19.48 35.4,9.99 | 35.4,9.99 34.95,10.44 v33.76,10.44
!RST_SENS  (via drill 0.35)
  Top 0.254: J2.4 67.18,5.33 64.63,7.88 R9.1 v60.7,13.12 58.67,15.15 S1.2 | IC5.18 67.31,14.52 v67.31,13.11
  Bottom 0.254: v67.31,13.11 60.72,13.11 v60.7,13.12
!RST_SSID  (via drill 0.35, 0.4)
  Top 0.254: v24.99,7.7 24.99,3.81 S5.2 | IC2.26 25.01,14.29 v24.99,14.28
  Bottom 0.254: v24.99,14.28 v24.99,7.7
+3V3  (via drill 0.35)
  Top 0.254: IC5.24 71.29,13.76 | IC4.6 40.39,14.91 | 40.39,14.91 IC4.7 | C5.2 C6.2 | C6.2 39.4,13.92 40.39,14.91 | 67.06,9.2 R9.2 65.76,9.23 R16.2 65.17,14.23 64.8,14.61 64.8,17.54 65.2,17.94 R15.2 | 67.06,9.2 68.39,9.2 R19.2 | 67.06,9.2 v67.06,10.11 | v71.07,8.36 71.07,4.52 J2.1 | C12.2 4.67,5.56 C13.2 | v11.96,5.44 13.83,5.44 R14.2 | R1.2 49.06,8.36 | R6.1 C6.2
  Top 0.406: 71.29,13.76 71.53,13.52 C14.2 71.51,11.76 71.51,8.79 v71.07,8.36 | v28.88,3.12 28.91,3.15 33.38,3.15 C4.2 C3.2 37.78,3.12 L1.2 39.54,8.36 | 39.54,8.36 49.06,8.36 v54.43,8.36 | v11.96,5.44 11.05,5.44 | 11.05,5.44 C13.2 | IC2.2 11.04,5.45 11.05,5.44 | 39.54,8.36 38.18,8.36 37.31,9.22 37.31,11.93 37.67,12.29 R6.1
  Bottom 0.254: v67.06,10.11 67.06,8.36
  Bottom 0.406: v28.88,3.12 14.28,3.12 v11.96,5.44 | v54.43,8.36 67.06,8.36 v71.07,8.36
+9V
  Top 0.406: S2.C1 54.6,25.66 56.28,23.98 D5.2
BAT+  (via drill 0.35)
  Top 0.406: v64.92,24.51 57.98,24.51 57.1,25.39 S2.B1
  Bottom 0.406: U1.2 73.56,9.21 73.56,18.88 64.97,24.46 v64.92,24.51
BOOT  (via drill 0.35)
  Top 0.254: IC2.25 30.52,26.63 32.79,24.36 v32.79,22.4 | v51.61,19.15 52.7,19.15 S4.2 | Q2.3 42.57,22.2 v43.33,21.44
  Bottom 0.254: v32.79,22.4 33.76,21.44 v43.33,21.44 49.33,21.44 v51.61,19.15
BST
  Top 0.254: C8.1 48.15,5.99 PS1.6
CONNECT_OK
  Top 0.254: IC2.10 21.22,9.6 21.22,2.58 20.93,2.29 13.11,2.29 11.96,3.43 LED1.3
DTR
  Top 0.203: 41.17,19.3 41.17,18.52 IC4.23
  Top 0.254: 41.17,19.3 41.17,25.93 Q2.2 41.62,27.59 41.6,27.61 41.99,27.99 R7.1
EN
  Top 0.254: R3.1 51.08,3.9 49.61,3.9 49.42,4.09 49.42,4.54 PS1.5
ERROR
  Top 0.254: IC2.11 22.47,2.4 21.77,1.7 12.22,1.7 11.57,2.35 LED1.1
ESPTOUCH
  Top 0.254: IC2.12 23.74,8.09 23.14,7.49 23.14,2.21 22.07,1.14 9.94,1.14 9.13,1.96 9.13,3.73 9.91,4.51 LED1.5
FB
  Top 0.254: PS1.4 50.05,6.34 R1.1 R2.2
GND  (via drill 0.35)
  Top 0.152: 17.27,17.04 IC2.47 | 10.1,26.63 IC2.38 | D3.1 v35.05,25.48 | D2.2 37.01,24.13 v36.65,24.49
  Top 0.203: IC5.23 70.42,13.09 v70.41,13.08
  Top 0.254: J1.MH2 32.9,26.79 J1.5 | C12.1 3.56,5.61 C13.1 | R11.2 R12.2 R13.2 3.51,5.31 C13.1 | C13.1 3.34,5.38 v1.83,5.38 | PS1.1 v46.66,2.36 | IC4.25 41.21,17.29 IC4.2 39.43,17.29 v38.76,17.96 | C11.1 16.59,3.39 | 16.59,3.39 18.07,3.39 S5.1 | C9.1 16.56,3.41 16.59,3.39 | C6.1 C5.1 R5.1
  Top 0.406: IC2.39 13.54,15.29 9.77,11.52 IC2.1 | IC2.39 IC2.40 IC2.41 | IC2.41 IC2.42 | IC2.42 IC2.43 IC2.44 IC2.45 | IC2.45 IC2.46 | IC2.46 15.52,17.04 | IC2.46 IC2.39 | IC2.46 IC2.47 IC2.42 | IC2.38 9.77,22.77 13.58,18.96 IC2.45 | IC2.46 13.62,17.13 v13.61,17.12 | C14.1 v74.73,11.79 | S1.1 v58.67,13.64 | S4.1 v53.03,13.64 | S5.1 v18.11,4.75 | R5.1 v42.48,11.19 v42.49,11.18 | IC2.41 19.1,14.15 20.84,12.41 IC2.15 33.37,6.32 C4.1 C3.1 | R2.1 53.42,5.61 C2.1 C1.1 v55.63,6.27 | S3.1 v33.76,16.79
  pour Bottom (isolate 0.508): 0,31.75 81.28,31.75 81.28,0 0,0
IO5
  Top 0.254: IC2.29 21.2,29.06 J3.3
IO16
  Top 0.254: IC2.27 23.74,27.6 J3.1
IO17
  Top 0.254: IC2.28 22.47,28.33 J3.2
IO18
  Top 0.254: IC2.30 19.93,29.79 J3.4
IO19
  Top 0.254: IC2.31 18.66,29.68 J3.5
IO23
  Top 0.254: IC2.37 11.04,28.57 12.57,30.1 J3.6
N$1  (via drill 0.35)
  Top 0.203: 41.73,13.89 41.73,14.56 IC4.9
  Top 0.254: R6.2 38.33,11.16 v38.33,10.16 | v41.96,13.46 41.73,13.69 41.73,13.89
  Bottom 0.254: v38.33,10.16 38.66,10.16 v41.96,13.46
N$2
  Top 0.254: Q1.1 49.77,27.59 49.37,27.99 R7.2
N$3
  Top 0.254: R8.2 43.56,26.42 Q2.1
N$4
  Top 0.203: IC4.8 41.21,13.88 41.2,13.87
  Top 0.254: R5.2 41.2,12.59 41.2,13.87
  Top 0.406: R5.2 42.67,12.29 R4.2
N$6
  Top 0.254: R12.1 5.66,2.54 6.55,3.43 LED1.4
N$7
  Top 0.254: R11.1 6.29,1.32 LED1.2
N$8
  Top 0.254: LED1.6 5.39,4.51 R13.1
RTS
  Top 0.203: 43.2,19.38 IC4.19
  Top 0.254: Q1.2 46.26,26.4 | 46.26,26.4 R8.1 | 46.26,26.4 46.26,22.44 43.2,19.38
RXD  (via drill 0.35)
  Top 0.203: 42.7,19.18 42.7,18.5 IC4.20
  Top 0.254: v42.7,20.57 42.7,19.18 | R17.1 31.17,22.23 v31.83,21.57
  Bottom 0.254: v42.7,20.57 32.82,20.57 v31.83,21.57
RXD0  (via drill 0.35)
  Top 0.254: v30.81,24.99 31.17,24.64 R17.2 | IC2.34 v14.85,24.98 v14.86,24.97
  Bottom 0.254: v30.81,24.99 30.79,24.97 v14.86,24.97
SCL  (via drill 0.35)
  Top 0.203: IC5.16 67.08,15.88
  Top 0.254: v12.29,23.16 12.31,23.18 IC2.36 | R16.1 65.76,15.82 | 65.76,15.82 v65.76,16.51 | 65.76,15.82 65.81,15.88 67.08,15.88
  Bottom 0.254: v65.76,16.51 65.76,16.54 59.13,23.16 14.76,23.16 v12.29,23.16
SDA  (via drill 0.35, 0.4)
  Top 0.203: IC5.15 67.15,16.38 66.94,16.59
  Top 0.254: v16.72,28.3 16.12,27.7 IC2.33 | v65.79,20.5 R15.1 66.2,18.62 66.22,18.62 66.94,17.91 66.94,16.59
  Bottom 0.254: v65.79,20.5 57.98,28.3 41.32,28.3 39.05,30.57 30.45,30.57 28.18,28.3 v16.72,28.3
SENSOR
  Top 0.254: IC5.3 87.65,15.88 TP1.TP
  pour Top: 87.63,15.24 87.63,6.35 146.05,6.35 160.02,12.7 162.56,15.24 162.56,16.51 160.02,19.05 146.05,25.4 87.63,25.4
SW
  Top 0.254: PS1.2 49.1,3.1 48.58,3.62 | C8.2 47.23,7.36 46.4,6.53 46.4,4.93 46.4,4.88
  Top 0.305: 48.58,3.62 47.71,3.62 46.4,4.93
  Top 0.406: 46.4,4.88 L1.1
SWCLK
  Top 0.203: 68.42,13.28 IC5.19
  Top 0.254: 68.42,13.28 68.42,10.3 R19.1 68.91,10.28 69.16,10.02 69.16,2.43 J2.3
SWDIO
  Top 0.203: 68.94,13.23 68.94,14.12 IC5.20
  Top 0.254: J2.2 69.83,3.76 69.83,11.77 68.94,12.66 68.94,13.23
TXD  (via drill 0.35)
  Top 0.203: 42.19,19.25 42.19,18.51 IC4.21
  Top 0.254: v41.94,19.76 42.19,19.51 42.19,19.25 | R18.1 29.97,21.49 v30.66,20.8
  Bottom 0.254: v30.66,20.8 31.7,19.76 v41.94,19.76
TXD0  (via drill 0.35)
  Top 0.254: IC2.35 13.69,26.52 v13.69,24.31 | v29.62,24.16 29.97,23.8 R18.2
  Bottom 0.254: v13.69,24.31 13.84,24.16 v29.62,24.16
USB_D+
  Top 0.203: 34.75,21.77 FL1.2 | 39.22,16.76 39.99,16.76 IC4.3
  Top 0.254: 34.75,21.77 34.75,19.71 37.69,16.76 39.22,16.76
USB_D-  (via drill 0.35)
  Top 0.203: FL1.3 35.35,21.76 | 39.19,16.26 39.98,16.26 IC4.4
  Top 0.254: v37.48,18.13 35.35,20.25 35.35,21.76 | v37.47,15.98 37.74,16.26 39.19,16.26
  Bottom 0.254: v37.48,18.13 v37.47,18.12 v37.47,15.98
USB_DN
  Top 0.152: 35.71,24.55 35.39,24.23 D3.3 35.39,23.1 FL1.4
  Top 0.203: 35.71,24.55 35.81,24.65 35.81,25.84 35.4,26.26 J1.2
USB_DP
  Top 0.152: 34.71,27.3 J1.3 | 34.39,24.55 34.71,24.23 D3.2 34.71,23.1 FL1.1
  Top 0.203: 34.71,27.3 34.71,26.31 34.24,25.84 34.24,24.7 34.39,24.55
V+
  Top 0.254: J2.6 57.28,2.41 57.23,2.46
  Top 0.406: PS1.3 50.14,2.27 R3.2 53.35,2.27 C2.2 C1.2 56.97,2.21 57.23,2.46 57.48,2.72 57.48,6.71 55.93,8.26 55.93,21.88 | D4.1 54.44,22.45 55.01,21.88 55.93,21.88 | D5.1 59.13,22.45 58.56,21.88 55.93,21.88
VBUS  (via drill 0.35)
  Top 0.152: 37.93,24.44 37.93,24.25 D2.1
  Top 0.254: v40.26,24.11 38.26,24.11 37.93,24.44 35.99,26.38 35.99,27.28 J1.1 | 51.56,22.89 v50.37,24.08 | D4.2 51.56,22.91 50.8,22.91 46.25,18.36 46.25,13.18 45.41,12.34 R4.1
  Top 0.406: D4.2 51.56,22.89
  Bottom 0.254: v50.37,24.08 40.28,24.08 v40.26,24.11
(copper drawn outside any net)
  shapes: Top area x2

### Text on the board
tNames: SOIL SENSOR v1.0 | BOOT | RST_SENS | RST_ESP | SSID | 5V | GND | RST | TCK | TMS | VTref
bNames: ON | OFF | IO23 | IO19 | IO18 | IO5 | IO17 | IO16